# EAGLE design gyrotestbench (EAGLE 6.4)

## Sheet 1 of 5
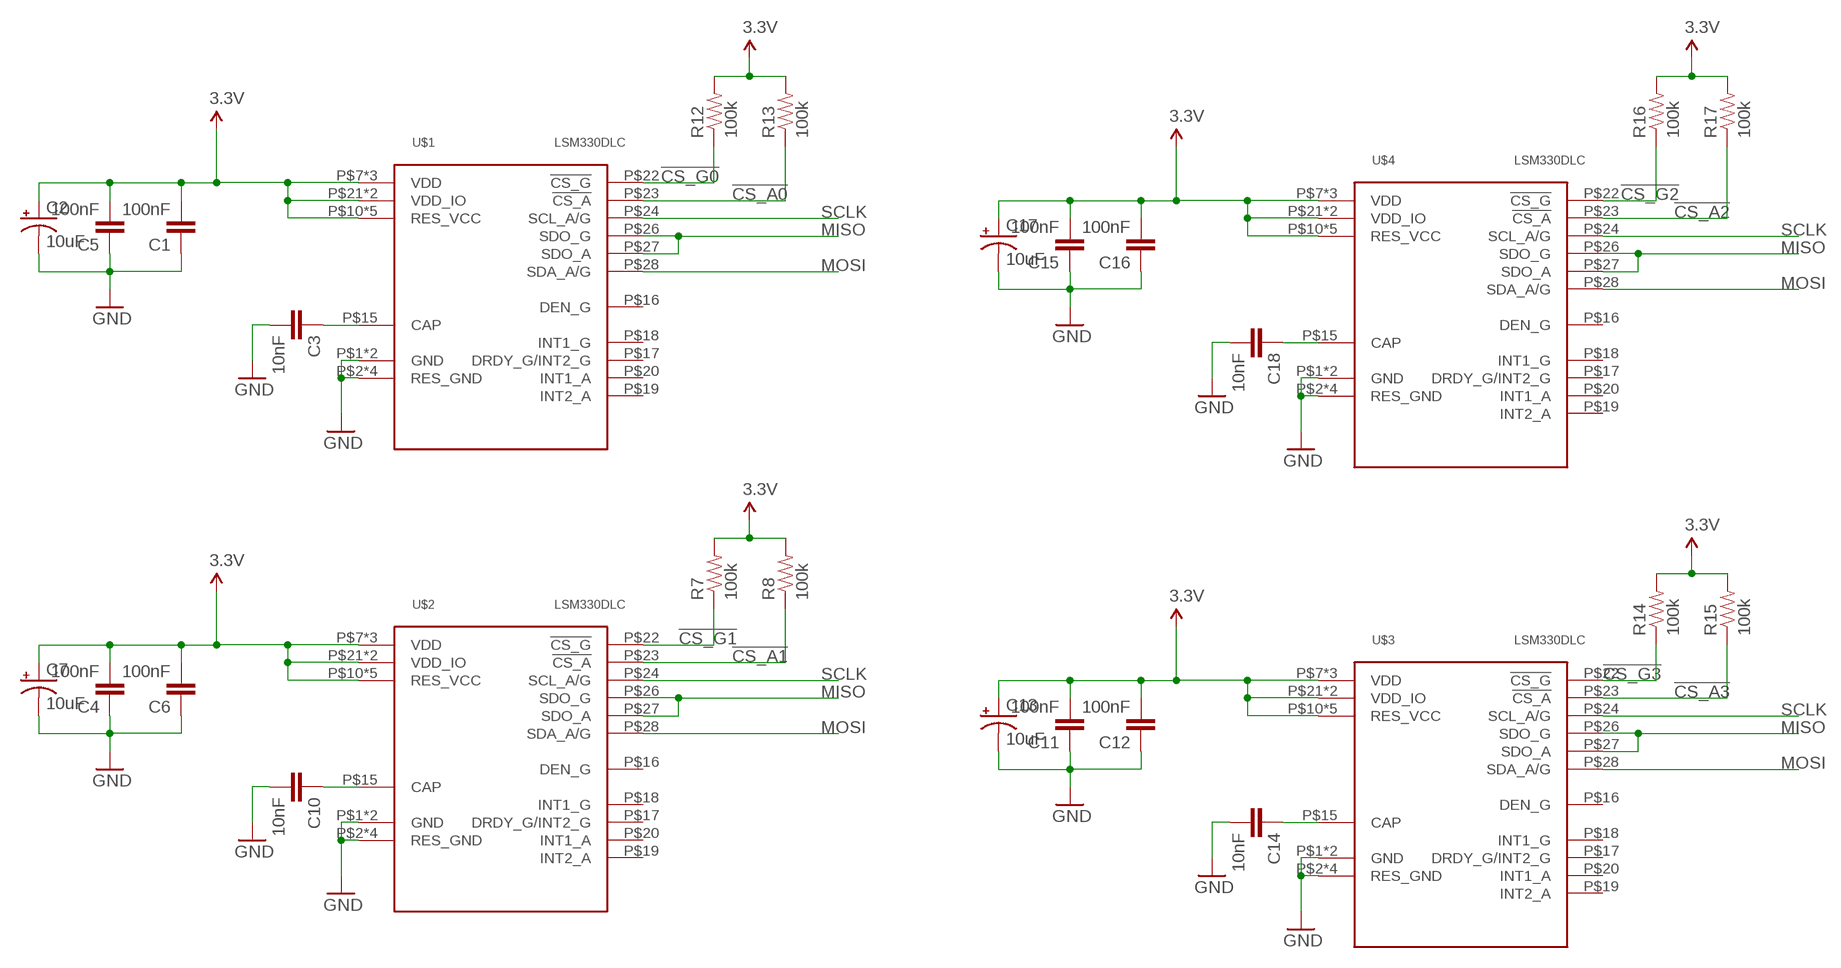
[diagram p0: schematic, sheet 1]

### Parts
C1  100nF  CAP0603-CAP  [0603-CAP]
C2  10uF  CPOL-USB  [PANASONIC_B]
C3  10nF  CAP0603-CAP  [0603-CAP]
C4  100nF  CAP0603-CAP  [0603-CAP]
C5  100nF  CAP0603-CAP  [0603-CAP]
C6  100nF  CAP0603-CAP  [0603-CAP]
C7  10uF  CPOL-USB  [PANASONIC_B]
C10  10nF  CAP0603-CAP  [0603-CAP]
C11  100nF  CAP0603-CAP  [0603-CAP]
C12  100nF  CAP0603-CAP  [0603-CAP]
C13  10uF  CPOL-USB  [PANASONIC_B]
C14  10nF  CAP0603-CAP  [0603-CAP]
C15  100nF  CAP0603-CAP  [0603-CAP]
C16  100nF  CAP0603-CAP  [0603-CAP]
C17  10uF  CPOL-USB  [PANASONIC_B]
C18  10nF  CAP0603-CAP  [0603-CAP]
R7  100k  RESISTOR0603-RES  [0603-RES]
R8  100k  RESISTOR0603-RES  [0603-RES]
R12  100k  RESISTOR0603-RES  [0603-RES]
R13  100k  RESISTOR0603-RES  [0603-RES]
R14  100k  RESISTOR0603-RES  [0603-RES]
R15  100k  RESISTOR0603-RES  [0603-RES]
R16  100k  RESISTOR0603-RES  [0603-RES]
R17  100k  RESISTOR0603-RES  [0603-RES]
U$1  LSM330DLC  [LGA-28]
U$2  LSM330DLC  [LGA-28]
U$3  LSM330DLC  [LGA-28]
U$4  LSM330DLC  [LGA-28]

### Nets
3.3V: C1.2 C2.+ C4.2 C5.2 C6.2 C7.+ C11.2 C12.2 C13.+ C15.2 C16.2 C17.+ R7.2 R8.2 R12.2 R13.2 R14.2 R15.2 R16.2 R17.2 U$1.P$7(VDD) U$1.P$8(VDD) U$1.P$9(VDD) U$1.P$10(RES_VCC) U$1.P$11(RES_VCC) U$1.P$12(RES_VCC) U$1.P$13(RES_VCC) U$1.P$14(RES_VCC) U$1.P$21(VDD_IO) U$1.P$25(VDD_IO) U$2.P$7(VDD) U$2.P$8(VDD) U$2.P$9(VDD) U$2.P$10(RES_VCC) U$2.P$11(RES_VCC) U$2.P$12(RES_VCC) U$2.P$13(RES_VCC) U$2.P$14(RES_VCC) U$2.P$21(VDD_IO) U$2.P$25(VDD_IO) U$3.P$7(VDD) U$3.P$8(VDD) U$3.P$9(VDD) U$3.P$10(RES_VCC) U$3.P$11(RES_VCC) U$3.P$12(RES_VCC) U$3.P$13(RES_VCC) U$3.P$14(RES_VCC) U$3.P$21(VDD_IO) U$3.P$25(VDD_IO) U$4.P$7(VDD) U$4.P$8(VDD) U$4.P$9(VDD) U$4.P$10(RES_VCC) U$4.P$11(RES_VCC) U$4.P$12(RES_VCC) U$4.P$13(RES_VCC) U$4.P$14(RES_VCC) U$4.P$21(VDD_IO) U$4.P$25(VDD_IO) ; also sheet 2,3,4,5
!CS_A0: R13.1 U$1.P$23(!CS_A) ; also sheet 5
!CS_A1: R8.1 U$2.P$23(!CS_A) ; also sheet 5
!CS_A2: R17.1 U$4.P$23(!CS_A) ; also sheet 5
!CS_A3: R15.1 U$3.P$23(!CS_A) ; also sheet 5
!CS_G0: R12.1 U$1.P$22(!CS_G) ; also sheet 5
!CS_G1: R7.1 U$2.P$22(!CS_G) ; also sheet 5
!CS_G2: R16.1 U$4.P$22(!CS_G) ; also sheet 5
!CS_G3: R14.1 U$3.P$22(!CS_G) ; also sheet 5
GND: C1.1 C2.- C3.2 C4.1 C5.1 C6.1 C7.- C10.2 C11.1 C12.1 C13.- C14.2 C15.1 C16.1 C17.- C18.2 U$1.P$1(GND) U$1.P$2(RES_GND) U$1.P$3(RES_GND) U$1.P$4(RES_GND) U$1.P$5(RES_GND) U$1.P$6(GND) U$2.P$1(GND) U$2.P$2(RES_GND) U$2.P$3(RES_GND) U$2.P$4(RES_GND) U$2.P$5(RES_GND) U$2.P$6(GND) U$3.P$1(GND) U$3.P$2(RES_GND) U$3.P$3(RES_GND) U$3.P$4(RES_GND) U$3.P$5(RES_GND) U$3.P$6(GND) U$4.P$1(GND) U$4.P$2(RES_GND) U$4.P$3(RES_GND) U$4.P$4(RES_GND) U$4.P$5(RES_GND) U$4.P$6(GND) ; also sheet 2,3,4,5
MISO: U$1.P$26(SDO_G) U$1.P$27(SDO_A) U$2.P$26(SDO_G) U$2.P$27(SDO_A) U$3.P$26(SDO_G) U$3.P$27(SDO_A) U$4.P$26(SDO_G) U$4.P$27(SDO_A) ; also sheet 5
MOSI: U$1.P$28(SDA_A/G) U$2.P$28(SDA_A/G) U$3.P$28(SDA_A/G) U$4.P$28(SDA_A/G) ; also sheet 5
N$1: C3.1 U$1.P$15(CAP)
N$2: C10.1 U$2.P$15(CAP)
N$3: C14.1 U$3.P$15(CAP)
N$4: C18.1 U$4.P$15(CAP)
SCLK: U$1.P$24(SCL_A/G) U$2.P$24(SCL_A/G) U$3.P$24(SCL_A/G) U$4.P$24(SCL_A/G) ; also sheet 5
Unconnected: U$1.P$16(DEN_G) U$1.P$17(DRDY_G/INT2_G) U$1.P$18(INT1_G) U$1.P$19(INT2_A) U$1.P$20(INT1_A) U$2.P$16(DEN_G) U$2.P$17(DRDY_G/INT2_G) U$2.P$18(INT1_G) U$2.P$19(INT2_A) U$2.P$20(INT1_A) U$3.P$16(DEN_G) U$3.P$17(DRDY_G/INT2_G) U$3.P$18(INT1_G) U$3.P$19(INT2_A) U$3.P$20(INT1_A) U$4.P$16(DEN_G) U$4.P$17(DRDY_G/INT2_G) U$4.P$18(INT1_G) U$4.P$19(INT2_A) U$4.P$20(INT1_A)

## Sheet 2 of 5
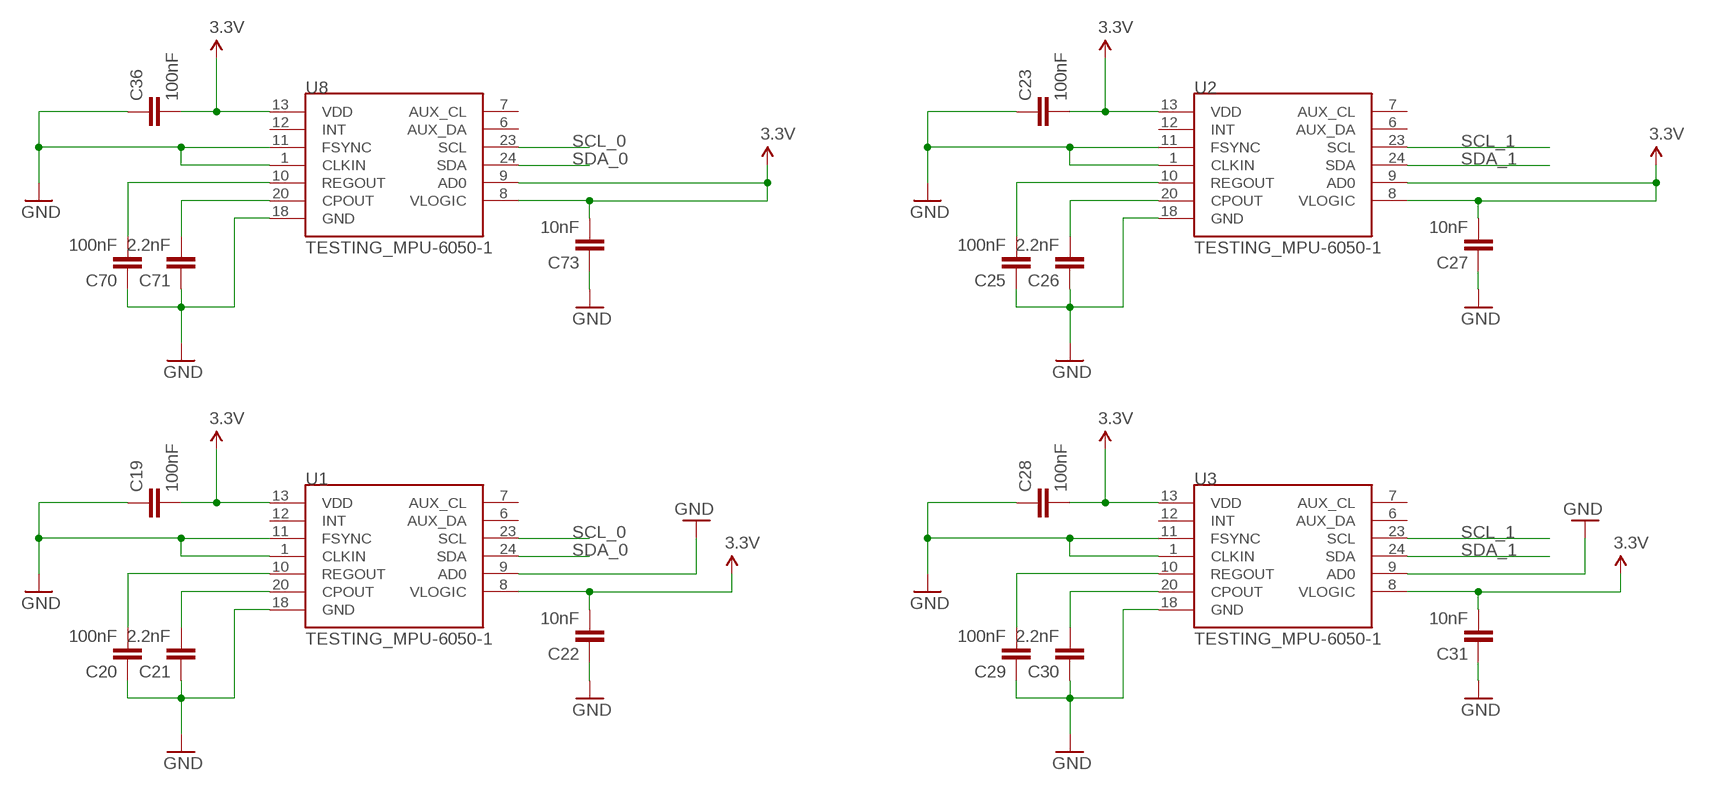
[diagram p1: schematic, sheet 2]

### Parts
C19  100nF  CAP0603-CAP  [0603-CAP]
C20  100nF  CAP0603-CAP  [0603-CAP]
C21  2.2nF  CAP0603-CAP  [0603-CAP]
C22  10nF  CAP0603-CAP  [0603-CAP]
C23  100nF  CAP0603-CAP  [0603-CAP]
C25  100nF  CAP0603-CAP  [0603-CAP]
C26  2.2nF  CAP0603-CAP  [0603-CAP]
C27  10nF  CAP0603-CAP  [0603-CAP]
C28  100nF  CAP0603-CAP  [0603-CAP]
C29  100nF  CAP0603-CAP  [0603-CAP]
C30  2.2nF  CAP0603-CAP  [0603-CAP]
C31  10nF  CAP0603-CAP  [0603-CAP]
C36  100nF  CAP0603-CAP  [0603-CAP]
C70  100nF  CAP0603-CAP  [0603-CAP]
C71  2.2nF  CAP0603-CAP  [0603-CAP]
C73  10nF  CAP0603-CAP  [0603-CAP]
U1  TESTING_MPU-6050-1  [TESTING_QFN-24-4MM2]
U2  TESTING_MPU-6050-1  [TESTING_QFN-24-4MM2]
U3  TESTING_MPU-6050-1  [TESTING_QFN-24-4MM2]
U8  TESTING_MPU-6050-1  [TESTING_QFN-24-4MM2]

### Nets
3.3V: C19.2 C22.2 C23.2 C27.2 C28.2 C31.2 C36.2 C73.2 U1.8(VLOGIC) U1.13(VDD) U2.8(VLOGIC) U2.9(AD0) U2.13(VDD) U3.8(VLOGIC) U3.13(VDD) U8.8(VLOGIC) U8.9(AD0) U8.13(VDD) ; also sheet 1,3,4,5
GND: C19.1 C20.1 C21.1 C22.1 C23.1 C25.1 C26.1 C27.1 C28.1 C29.1 C30.1 C31.1 C36.1 C70.1 C71.1 C73.1 U1.1(CLKIN) U1.9(AD0) U1.11(FSYNC) U1.18(GND) U2.1(CLKIN) U2.11(FSYNC) U2.18(GND) U3.1(CLKIN) U3.9(AD0) U3.11(FSYNC) U3.18(GND) U8.1(CLKIN) U8.11(FSYNC) U8.18(GND) ; also sheet 1,3,4,5
N$5: C20.2 U1.10(REGOUT)
N$6: C21.2 U1.20(CPOUT)
N$7: C25.2 U2.10(REGOUT)
N$8: C26.2 U2.20(CPOUT)
N$9: C29.2 U3.10(REGOUT)
N$10: C30.2 U3.20(CPOUT)
N$38: C70.2 U8.10(REGOUT)
N$39: C71.2 U8.20(CPOUT)
SCL_0: U1.23(SCL) U8.23(SCL) ; also sheet 3
SCL_1: U2.23(SCL) U3.23(SCL) ; also sheet 3
SDA_0: U1.24(SDA) U8.24(SDA) ; also sheet 3
SDA_1: U2.24(SDA) U3.24(SDA) ; also sheet 3
Unconnected: U1.6(AUX_DA) U1.7(AUX_CL) U1.12(INT) U2.6(AUX_DA) U2.7(AUX_CL) U2.12(INT) U3.6(AUX_DA) U3.7(AUX_CL) U3.12(INT) U8.6(AUX_DA) U8.7(AUX_CL) U8.12(INT)

## Sheet 3 of 5
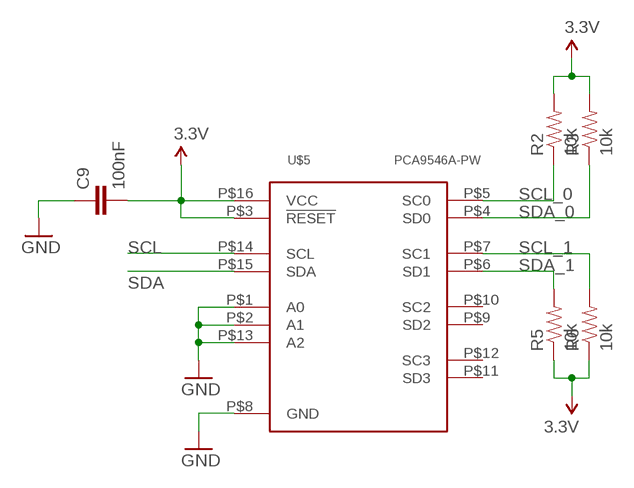
[diagram p2: schematic, sheet 3]

### Parts
C9  100nF  CAP0603-CAP  [0603-CAP]
R2  10k  RESISTOR0603-RES  [0603-RES]
R3  10k  RESISTOR0603-RES  [0603-RES]
R5  10k  RESISTOR0603-RES  [0603-RES]
R6  10k  RESISTOR0603-RES  [0603-RES]
U$5  PCA9546A-PW  [TSSOP-16]

### Nets
3.3V: C9.2 R2.2 R3.2 R5.1 R6.1 U$5.P$3(!RESET) U$5.P$16(VCC) ; also sheet 1,2,4,5
GND: C9.1 U$5.P$1(A0) U$5.P$2(A1) U$5.P$8(GND) U$5.P$13(A2) ; also sheet 1,2,4,5
SCL: U$5.P$14(SCL) ; also sheet 5
SCL_0: R2.1 U$5.P$5(SC0) ; also sheet 2
SCL_1: R6.2 U$5.P$7(SC1) ; also sheet 2
SDA: U$5.P$15(SDA) ; also sheet 5
SDA_0: R3.1 U$5.P$4(SD0) ; also sheet 2
SDA_1: R5.2 U$5.P$6(SD1) ; also sheet 2
Unconnected: U$5.P$9(SD2) U$5.P$10(SC2) U$5.P$11(SD3) U$5.P$12(SC3)

## Sheet 4 of 5
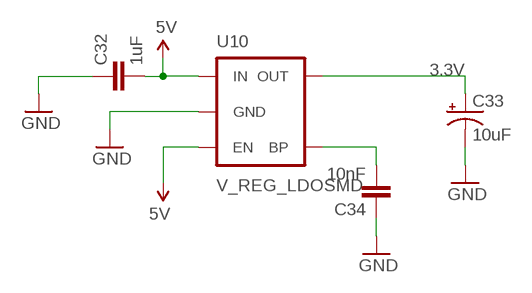
[diagram p3: schematic, sheet 4]

### Parts
C32  1uF  CAP0603-CAP  [0603-CAP]
C33  10uF  CPOL-USB  [PANASONIC_B]
C34  10nF  CAP0603-CAP  [0603-CAP]
U10  V_REG_LDOSMD  [SOT23-5]

### Nets
3.3V: C33.+ U10.5(OUT) ; also sheet 1,2,3,5
5V: C32.2 U10.1(IN) U10.3(EN) ; also sheet 5
GND: C32.1 C33.- C34.1 U10.2(GND) ; also sheet 1,2,3,5
N$11: C34.2 U10.4(BP)

## Sheet 5 of 5
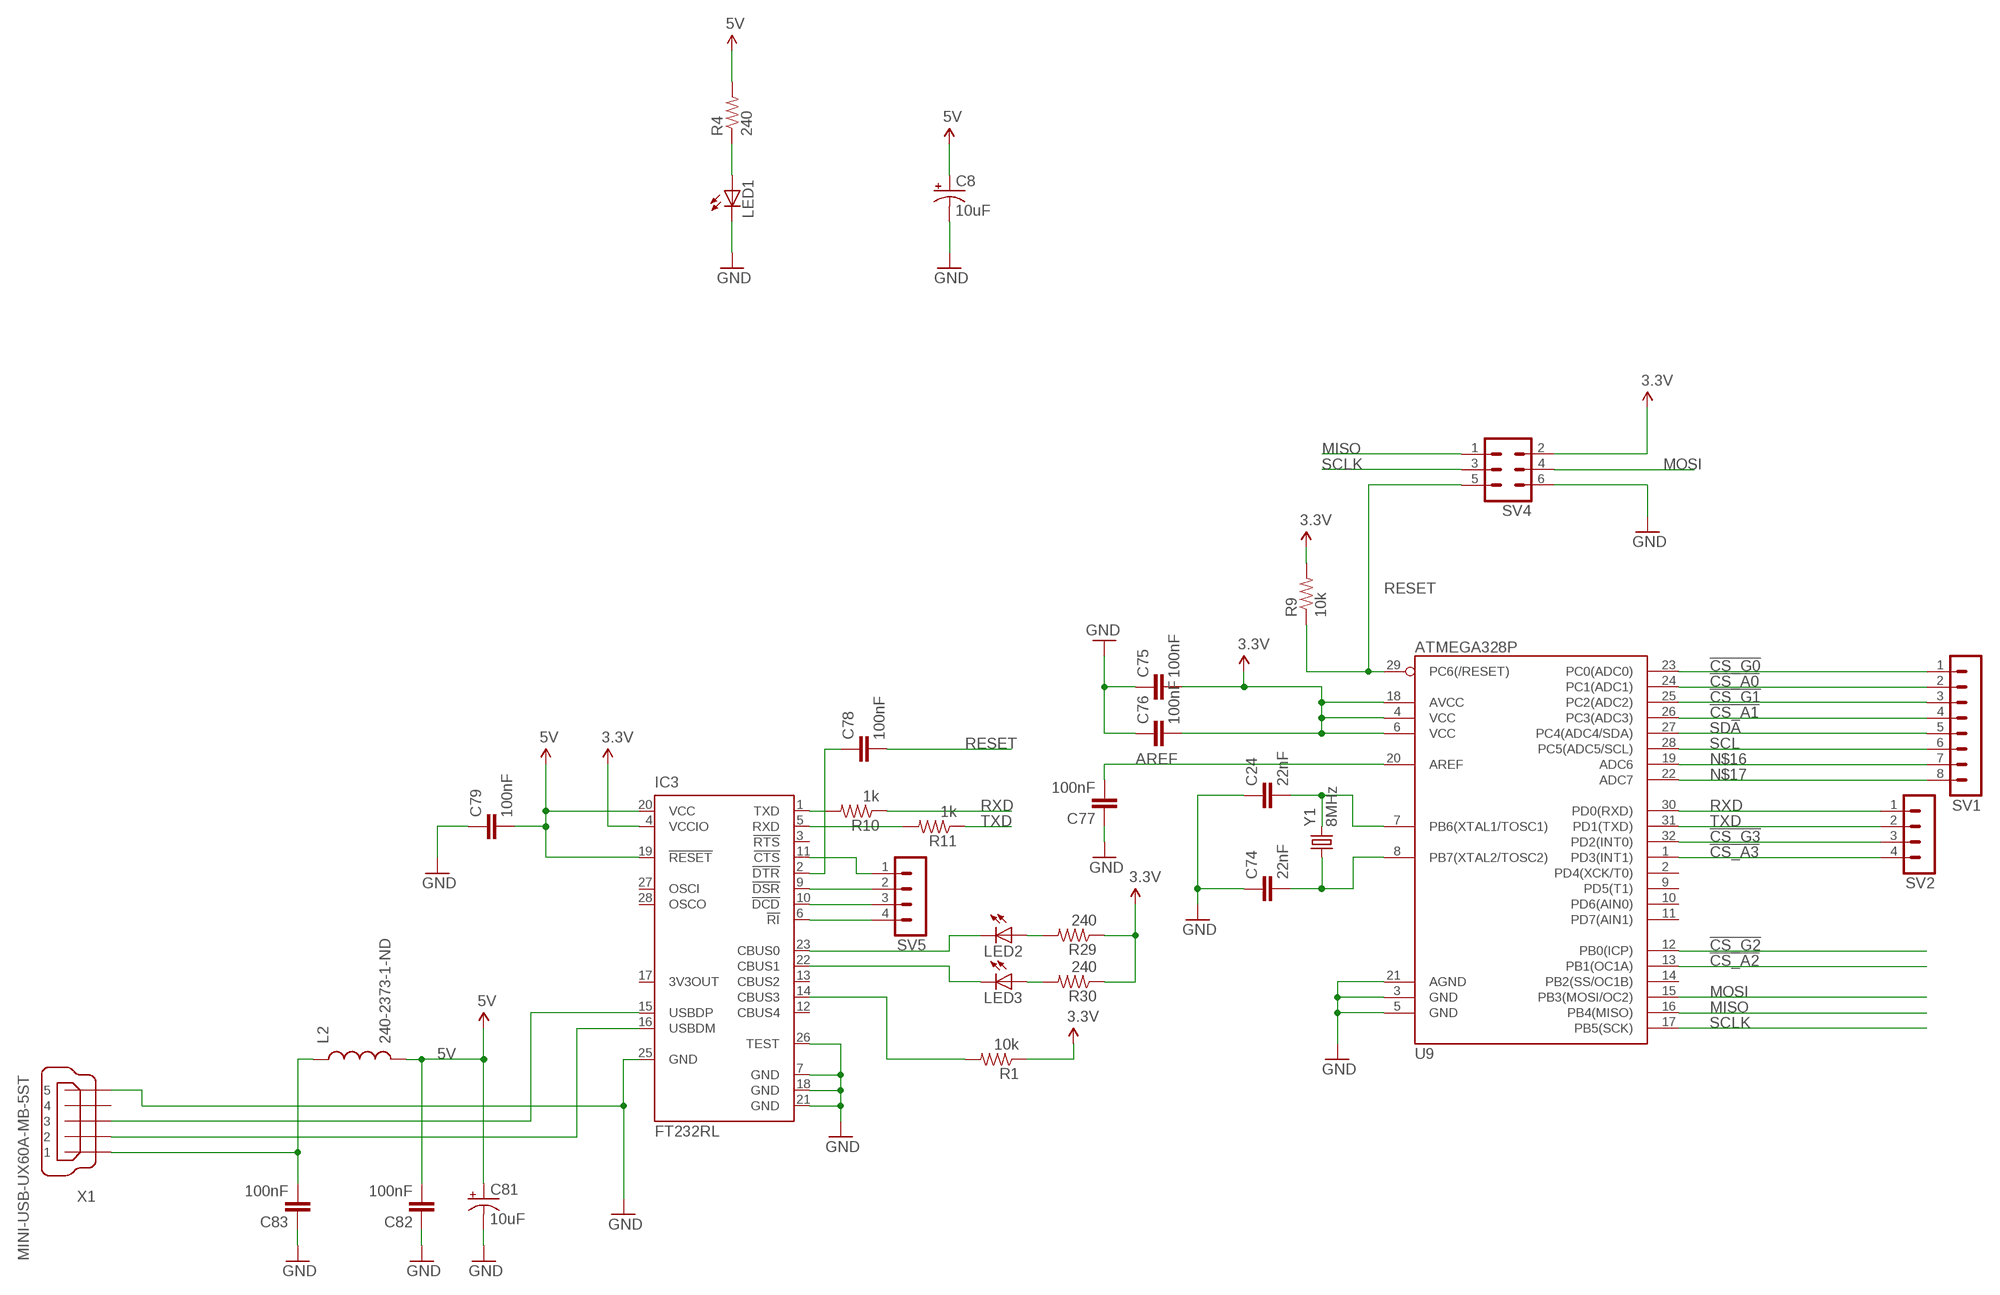
[diagram p4: schematic, sheet 5]

### Parts
C8  10uF  CPOL-USB  [PANASONIC_B]
C24  22nF  CAP0603-CAP  [0603-CAP]
C74  22nF  CAP0603-CAP  [0603-CAP]
C75  100nF  CAP0603-CAP  [0603-CAP]
C76  100nF  CAP0603-CAP  [0603-CAP]
C77  100nF  CAP0603-CAP  [0603-CAP]
C78  100nF  CAP0603-CAP  [0603-CAP]
C79  100nF  CAP0603-CAP  [0603-CAP]
C81  10uF  CPOL-USB  [PANASONIC_B]
C82  100nF  CAP0603-CAP  [0603-CAP]
C83  100nF  CAP0603-CAP  [0603-CAP]
IC3  FT232RL  [SSOP28]
L2  240-2373-1-ND  INDUCTOR0603  [0603]
LED1  LED0603  [LED-0603]
LED2  LED0603  [LED-0603]
LED3  LED0603  [LED-0603]
R1  10k  RESISTOR0603-RES  [0603-RES]
R4  240  RESISTOR0603-RES  [0603-RES]
R9  10k  RESISTOR0603-RES  [0603-RES]
R10  1k  RESISTOR0603-RES  [0603-RES]
R11  1k  RESISTOR0603-RES  [0603-RES]
R29  240  RESISTOR0603-RES  [0603-RES]
R30  240  RESISTOR0603-RES  [0603-RES]
SV1  MA08-1  [MA08-1]
SV2  MA04-1  [MA04-1]
SV4  MA03-2  [MA03-2]
SV5  MA04-1  [MA04-1]
U9  ATMEGA328P  ATMEGA328_SMT  [TQFP32-08]
X1  MINI-USB-UX60A-MB-5ST  [UX60A-MB-5ST]
Y1  8MHz  CRYSTALHC49US  [HC49US]

### Nets
3.3V: C75.2 C76.2 IC3.4(VCCIO) R1.1 R9.2 R29.1 R30.1 SV4.2 U9.4(VCC) U9.6(VCC) U9.18(AVCC) ; also sheet 1,2,3,4
5V: C8.+ C79.2 C81.+ C82.2 IC3.19(!RESET) IC3.20(VCC) L2.2 R4.2 ; also sheet 4
!CS_A0: SV1.2 U9.24(PC1(ADC1)) ; also sheet 1
!CS_A1: SV1.4 U9.26(PC3(ADC3)) ; also sheet 1
!CS_A2: U9.13(PB1(OC1A)) ; also sheet 1
!CS_A3: SV2.4 U9.1(PD3(INT1)) ; also sheet 1
!CS_G0: SV1.1 U9.23(PC0(ADC0)) ; also sheet 1
!CS_G1: SV1.3 U9.25(PC2(ADC2)) ; also sheet 1
!CS_G2: U9.12(PB0(ICP)) ; also sheet 1
!CS_G3: SV2.3 U9.32(PD2(INT0)) ; also sheet 1
AREF: C77.2 U9.20(AREF)
GND: C8.- C24.1 C74.1 C75.1 C76.1 C77.1 C79.1 C81.- C82.1 C83.1 IC3.7(GND) IC3.18(GND) IC3.21(GND) IC3.25(GND) IC3.26(TEST) LED1.C SV4.6 U9.3(GND) U9.5(GND) U9.21(AGND) X1.5 ; also sheet 1,2,3,4
MISO: SV4.1 U9.16(PB4(MISO)) ; also sheet 1
MOSI: SV4.4 U9.15(PB3(MOSI/OC2)) ; also sheet 1
N$12: IC3.14(CBUS3) R1.2
N$13: IC3.15(USBDP) X1.3
N$14: C83.2 L2.1 X1.1
N$15: IC3.16(USBDM) X1.2
N$16: SV1.7 U9.19(ADC6)
N$17: SV1.8 U9.22(ADC7)
N$55: IC3.1(TXD) R10.2
N$74: C78.1 IC3.2(!DTR)
N$84: IC3.5(RXD) R11.2
N$85: IC3.11(!CTS) SV5.1
N$86: IC3.9(!DSR) SV5.2
N$87: C24.2 U9.7(PB6(XTAL1/TOSC1)) Y1.2
N$88: C74.2 U9.8(PB7(XTAL2/TOSC2)) Y1.1
N$89: LED1.A R4.1
N$91: IC3.10(!DCD) SV5.3
N$92: IC3.6(!RI) SV5.4
N$93: IC3.23(CBUS0) LED2.C
N$94: IC3.22(CBUS1) LED3.C
N$95: LED2.A R29.2
N$96: LED3.A R30.2
RESET: C78.2 R9.1 SV4.5 U9.29(PC6(/RESET))
RXD: R10.1 SV2.1 U9.30(PD0(RXD))
SCL: SV1.6 U9.28(PC5(ADC5/SCL)) ; also sheet 3
SCLK: SV4.3 U9.17(PB5(SCK)) ; also sheet 1
SDA: SV1.5 U9.27(PC4(ADC4/SDA)) ; also sheet 3
TXD: R11.1 SV2.2 U9.31(PD1(TXD))
Unconnected: IC3.3(!RTS) IC3.12(CBUS4) IC3.13(CBUS2) IC3.17(3V3OUT) IC3.27(OSCI) IC3.28(OSCO) U9.2(PD4(XCK/T0)) U9.9(PD5(T1)) U9.10(PD6(AIN0)) U9.11(PD7(AIN1)) U9.14(PB2(SS/OC1B)) X1.4

## Library data of the parts
C1 C3-C6 C9-C12 C14-C16 C18-C32 C34 C36 C70 C71 C73-C79 C82 C83 = SparkFun-Capacitors:CAP: Capacitor Standard 0603 ceramic capacitor, and 0.1" leaded capacitor.
C2 C7 C8 C13 C17 C33 C81 = rcl:CPOL-US: POLARIZED CAPACITOR, American symbol
IC3 = ftdichip:FT232R: Source: http://www.ftdichip.com/Documents/DataSheets/DS_FT232R_v104.pdf; MPN: FT232RL; OC_FARNELL: 1146032; OC_NEWARK: 91K9918
L2 = SparkFun-Passives:INDUCTOR: Inductors Basic Inductor/Choke - 0603 and 1206. Footprints are not proven and vary greatly between part numbers.
LED1-LED3 = SparkFun-LED:LED: LEDs Standard schematic elements and footprints for 5mm, 3mm, 1206, and 0603 sized LEDs. 5mm - Spark Fun Electronics SKU : COM-00529 (and others)
R1-R17 R29 R30 = SparkFun-Resistors:RESISTOR: Resistor Basic schematic elements and footprints for 0603, 1206, and PTH resistors.
SV1 = con-lstb:MA08-1: PIN HEADER; OC_FARNELL: unknown; OC_NEWARK: unknown
SV2 SV5 = con-lstb:MA04-1: PIN HEADER; OC_FARNELL: unknown; OC_NEWARK: unknown
SV4 = con-lstb:MA03-2: PIN HEADER; OC_FARNELL: unknown; OC_NEWARK: unknown
U1-U3 U8 = MPU-6050_Breakout_V11:TESTING_MPU-6050
U9 = SparkFun-DigitalIC:ATMEGA328_SMT: 32-Pin Atmega328 part Commonly used on Arduino compatible boards Available in QFP and QFN packages TQFP is IC-09069 QFN is non-stock; PROD_ID: IC-09069
U10 = SparkFun-PowerIC:V_REG_LDO: Voltage Regulator LDO Standard 150mA LDO voltage regulator in SOT-23 layout. Micrel part MIC5205. BP (by-pass) pin is used to lower output noise with 470pF cap.
U$1-U$4 = gyrolib:LSM330DLC; DIGIKEY: 497-12400-1-ND
U$5 = gyrolib:PCA9546A-PW
X1 = con-hirose:MINI-USB-: MINI USB Connector Source: http://www.hirose.co.jp/cataloge_hp/e24000019.pdf; OC_FARNELL: unknown; OC_NEWARK: unknown
Y1 = SparkFun-FreqCtrl:CRYSTAL: Various standard crystals. Proven footprints. Spark Fun Electronics SKU : COM-00534

## Board
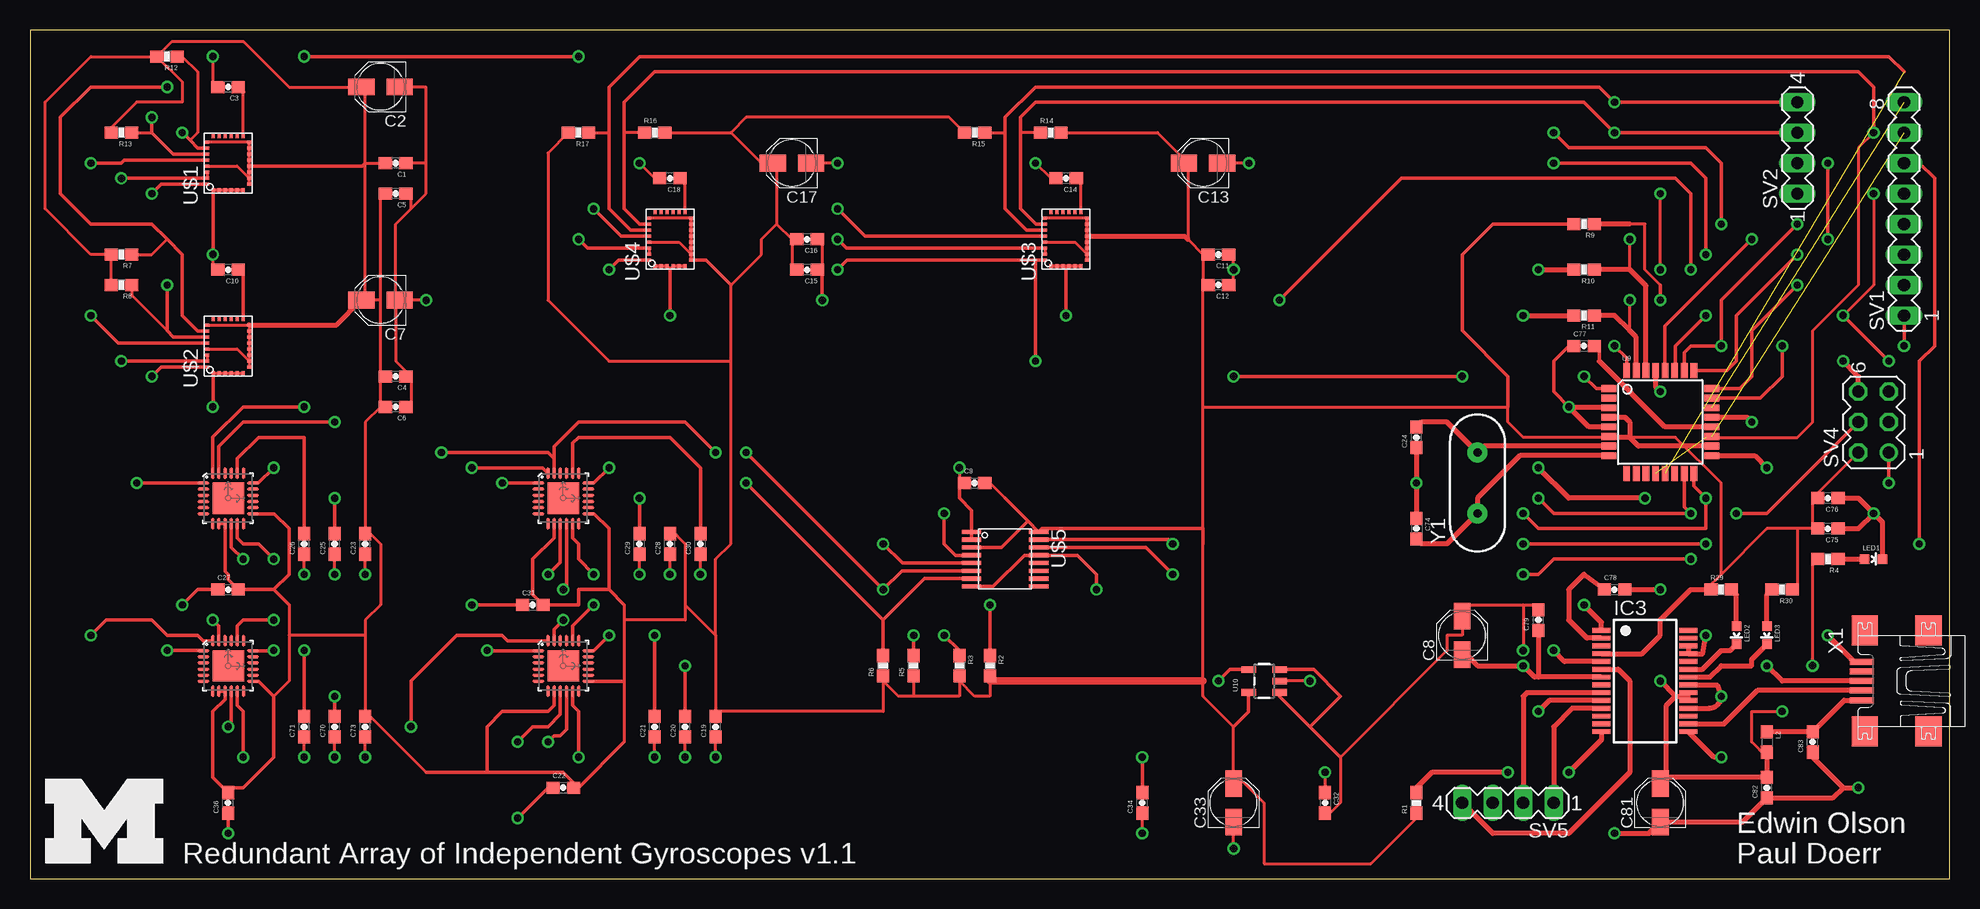
[diagram p5: board, top side]
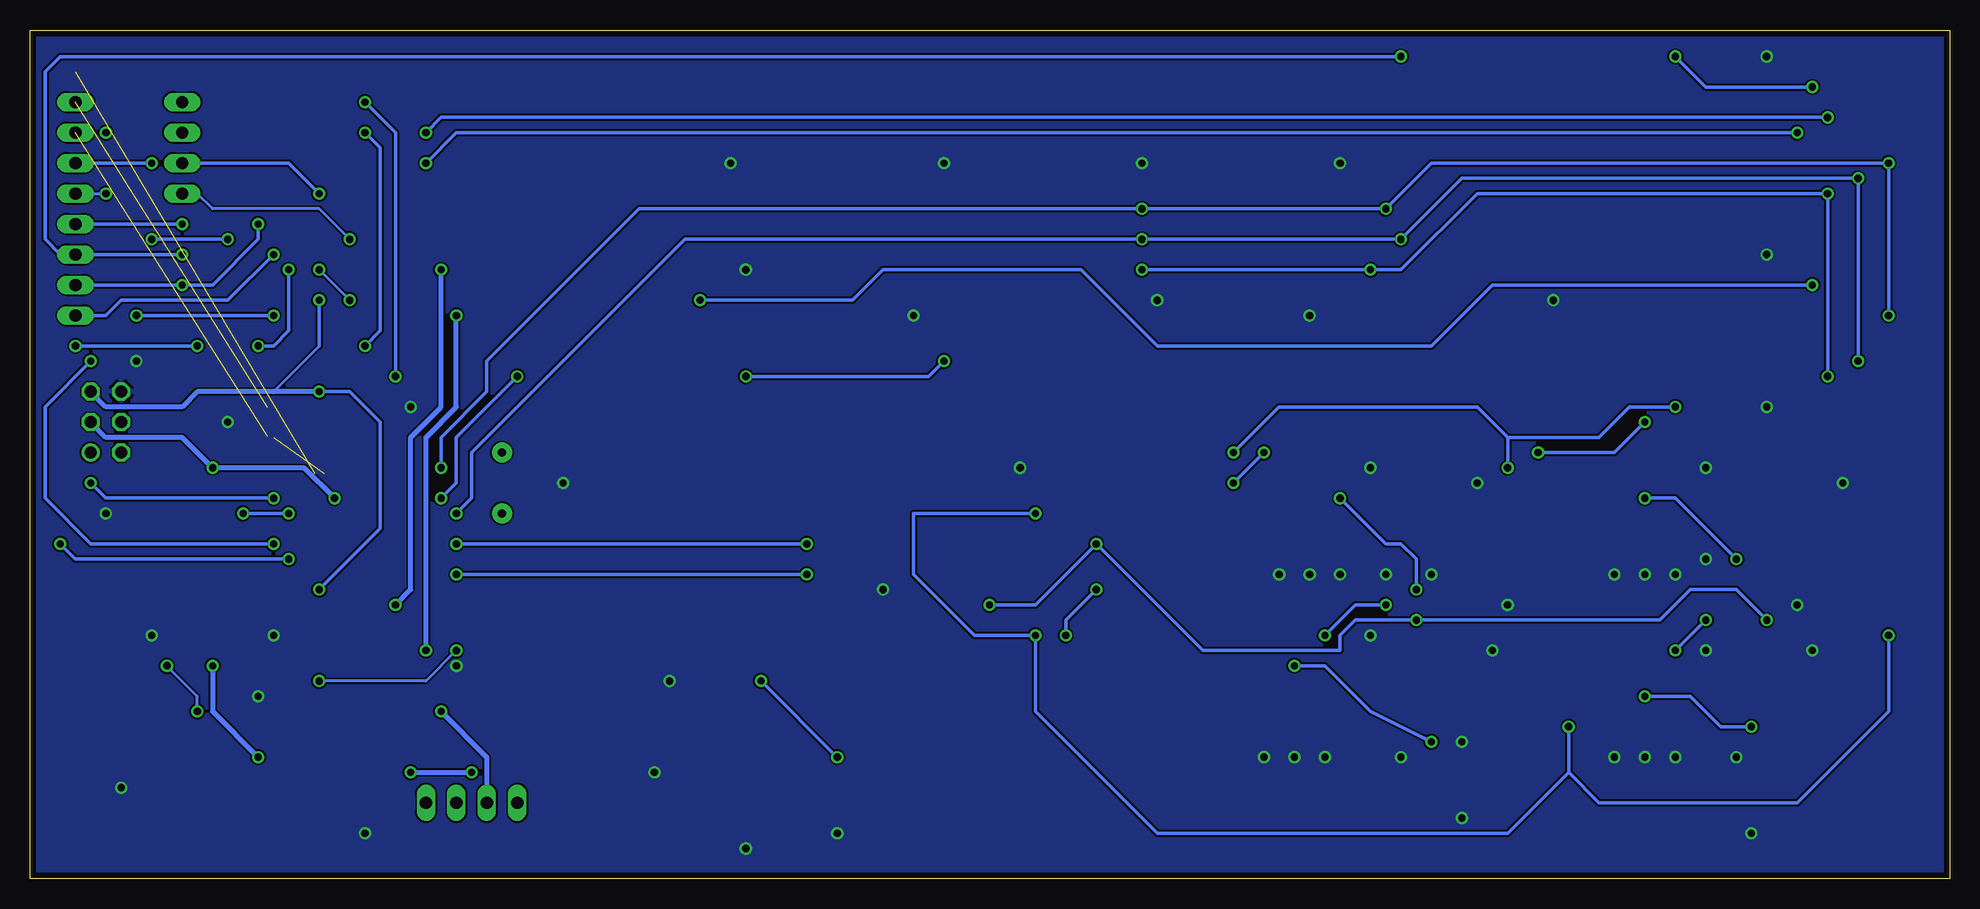
[diagram p6: board, bottom side, seen from below]

Size 160 x 70.79 mm. Coordinates in mm from the lower left corner, seen from the top.
Outline: 0,0 160,0 160,70.79 0,70.79 0,0
Copper layers (1*16): Top 0.0178mm / dielectric 59mil / Bottom 0.0178mm
Design rules "default": minimum track width 6mil, minimum drill 14mil, track to track 6mil, track to pad 6mil, pad to pad 6mil, via to via 6mil, smd to smd 6mil, copper to edge 20mil, drill to drill 16mil, minimum pad ring 8mil, minimum via ring 8mil, stop-mask expansion 3mil, vias tented up to drill 0mil, thermal gap 10mil

### Footprints (pad centres in the part's own frame; a part is rotated, then mirrored left to right if it is on the bottom)
0603-CAP = smd 1.1 x 1: 1 -0.85,0; 2 0.85,0
PANASONIC_B = smd 2.2 x 1.4: + 1.6,0; - -1.6,0
SSOP28 = smd 0.4 x 1.5: 1 -4.225,-3.625; 2 -3.575,-3.625; 3 -2.925,-3.625; 4 -2.275,-3.625; 5 -1.625,-3.625; 6 -0.975,-3.625; 7 -0.325,-3.625; 8 0.325,-3.625; 9 0.975,-3.625; 10 1.625,-3.625; 11 2.275,-3.625; 12 2.925,-3.625; 13 3.575,-3.625; 14 4.225,-3.625; 15 4.225,3.625; 16 3.575,3.625; 17 2.925,3.625; 18 2.275,3.625; 19 1.625,3.625; 20 0.975,3.625; 21 0.325,3.625; 22 -0.325,3.625; 23 -0.975,3.625; 24 -1.625,3.625; 25 -2.275,3.625; 26 -2.925,3.625; 27 -3.575,3.625; 28 -4.225,3.625
0603 = smd 1.1 x 1: 1 -0.85,0; 2 0.85,0
LED-0603 = smd 0.8 x 0.8: A 0,-0.75; C 0,0.75
0603-RES = smd 1.1 x 1: 1 -0.85,0; 2 0.85,0
MA08-1 = drill 1.016 long: 1 -8.89,0; 2 -6.35,0; 3 -3.81,0; 4 -1.27,0; 5 1.27,0; 6 3.81,0; 7 6.35,0; 8 8.89,0
MA04-1 = drill 1.016 long: 1 -3.81,0; 2 -1.27,0; 3 1.27,0; 4 3.81,0
MA03-2 = drill 1.016: 1 -2.54,-1.27 | drill 1.016 octagon: 2 -2.54,1.27; 3 0,-1.27; 4 0,1.27; 5 2.54,-1.27; 6 2.54,1.27
TESTING_QFN-24-4MM2 = smd 1.016 x 0.254: 1 -2.066,1.257; 2 -2.066,0.75; 3 -2.066,0.247; 4 -2.066,-0.287; 5 -2.066,-0.792; 6 -2.066,-1.297; 13 2.086,-1.297; 14 2.086,-0.792; 15 2.086,-0.287; 16 2.086,0.247; 17 2.086,0.75; 18 2.086,1.257 | smd 0.254 x 1.016: 7 -1.267,-2.122; 8 -0.762,-2.122; 9 -0.258,-2.122; 10 0.278,-2.122; 11 0.78,-2.122; 12 1.287,-2.122; 19 1.287,2.082; 20 0.78,2.082; 21 0.278,2.082; 22 -0.258,2.082; 23 -0.762,2.082; 24 -1.267,2.082 | smd 2.616 x 2.616: P$1 0.02,-0.01
TQFP32-08 = smd 1.27 x 0.559: 1 -4.293,2.8; 2 -4.293,2; 3 -4.293,1.2; 4 -4.293,0.4; 5 -4.293,-0.4; 6 -4.293,-1.2; 7 -4.293,-2; 8 -4.293,-2.8; 17 4.293,-2.8; 18 4.293,-2; 19 4.293,-1.2; 20 4.293,-0.4; 21 4.293,0.4; 22 4.293,1.2; 23 4.293,2; 24 4.293,2.8 | smd 0.559 x 1.27: 9 -2.8,-4.293; 10 -2,-4.293; 11 -1.2,-4.293; 12 -0.4,-4.293; 13 0.4,-4.293; 14 1.2,-4.293; 15 2,-4.293; 16 2.8,-4.293; 25 2.8,4.293; 26 2,4.293; 27 1.2,4.293; 28 0.4,4.293; 29 -0.4,4.293; 30 -1.2,4.293; 31 -2,4.293; 32 -2.8,4.293
SOT23-5 = smd 0.55 x 1.2: 1 -0.95,-1.3; 2 0,-1.3; 3 0.95,-1.3; 4 0.95,1.3; 5 -0.95,1.3
LGA-28 = smd 0.325 x 0.25: P$1 -2.25,1.25; P$2 -2.25,0.75; P$3 -2.25,0.25; P$4 -2.25,-0.25; P$5 -2.25,-0.75; P$6 -2.25,-1.25; P$15 2.25,-1.25; P$16 2.25,-0.75; P$17 2.25,-0.25; P$18 2.25,0.25; P$19 2.25,0.75; P$20 2.25,1.25 | smd 0.25 x 0.325: P$7 -1.75,-1.75; P$8 -1.25,-1.75; P$9 -0.75,-1.75; P$10 -0.25,-1.75; P$11 0.25,-1.75; P$12 0.75,-1.75; P$13 1.25,-1.75; P$14 1.75,-1.75; P$21 1.75,1.75; P$22 1.25,1.75; P$23 0.75,1.75; P$24 0.25,1.75; P$25 -0.25,1.75; P$26 -0.75,1.75; P$27 -1.25,1.75; P$28 -1.75,1.75
TSSOP-16 = smd 0.35 x 1.6: P$1 -2.275,-2.8; P$2 -1.625,-2.8; P$3 -0.975,-2.8; P$4 -0.325,-2.8; P$5 0.325,-2.8; P$6 0.975,-2.8; P$7 1.625,-2.8; P$8 2.275,-2.8; P$9 2.275,2.8; P$10 1.625,2.8; P$11 0.975,2.8; P$12 0.325,2.8; P$13 -0.325,2.8; P$14 -0.975,2.8; P$15 -1.625,2.8; P$16 -2.275,2.8
UX60A-MB-5ST = smd 2 x 0.5: 1 2.25,1.6; 2 2.25,0.8; 3 2.25,0; 4 2.25,-0.8; 5 2.25,-1.6 | smd 2.2 x 2.5: M1 -3.3,-4.2; M2 -3.3,4.2; M3 2,4.2; M4 2,-4.2
HC49US = drill 0.7 pad 1.651: 1 -2.54,0; 2 2.54,0

### Placement (x,y rotation side)
C1  30.48,59.69 180 top
C2  29.21,66.04 180 top
C3  16.51,66.04 180 top
C4  30.48,41.91 180 top
C5  30.48,57.15 180 top
C6  30.48,39.37 180 top
C7  29.21,48.26 180 top
C8  119.38,20.32 90 top
C9  78.74,33.02 0 top
C10  16.51,50.8 180 top
C11  99.06,52.07 180 top
C12  99.06,49.53 180 top
C13  97.79,59.69 180 top
C14  86.36,58.42 180 top
C15  64.77,50.8 180 top
C16  64.77,53.34 180 top
C17  63.5,59.69 180 top
C18  53.34,58.42 180 top
C19  57.15,12.7 90 top
C20  54.61,12.7 90 top
C21  52.07,12.7 90 top
C22  44.45,7.62 0 top
C23  27.94,27.94 90 top
C24  115.57,36.83 90 top
C25  25.4,27.94 90 top
C26  22.86,27.94 90 top
C27  16.51,24.13 0 top
C28  53.34,27.94 90 top
C29  50.8,27.94 90 top
C30  55.88,27.94 90 top
C31  41.91,22.86 0 top
C32  107.95,6.35 270 top
C33  100.33,6.35 90 top
C34  92.71,6.35 90 top
C36  16.51,6.35 90 top
C70  25.4,12.7 90 top
C71  22.86,12.7 90 top
C73  27.94,12.7 90 top
C74  115.57,29.21 270 top
C75  149.86,29.21 180 top
C76  149.86,31.75 180 top
C77  129.54,44.45 0 top
C78  132.08,24.13 0 top
C79  125.73,21.59 90 top
C81  135.89,6.35 90 top
C82  144.78,7.62 90 top
C83  148.59,11.43 90 top
IC3  134.62,16.51 270 top
L2  144.78,11.43 270 top
LED1  153.67,26.67 270 top
LED2  142.24,20.32 180 top
LED3  144.78,20.32 180 top
R1  115.57,6.35 90 top
R2  80.01,17.78 270 top
R3  77.47,17.78 270 top
R4  149.86,26.67 180 top
R5  73.66,17.78 90 top
R6  71.12,17.78 90 top
R7  7.62,52.07 180 top
R8  7.62,49.53 180 top
R9  129.54,54.61 180 top
R10  129.54,50.8 180 top
R11  129.54,46.99 180 top
R12  11.43,68.58 180 top
R13  7.62,62.23 180 top
R14  85.09,62.23 0 top
R15  78.74,62.23 180 top
R16  52.07,62.23 0 top
R17  45.72,62.23 180 top
R29  140.97,24.13 0 top
R30  146.05,24.13 180 top
SV1  156.21,55.88 90 top
SV2  147.32,60.96 90 top
SV4  153.67,38.1 90 top
SV5  123.19,6.35 180 top
U1  44.45,17.78 0 top
U2  16.51,31.75 0 top
U3  44.45,31.75 0 top
U8  16.51,17.78 0 top
U9  135.89,38.1 0 top
U10  102.87,16.51 90 top
U$1  16.51,59.69 90 top
U$2  16.51,44.45 90 top
U$3  86.36,53.34 90 top
U$4  53.34,53.34 90 top
U$5  81.28,26.67 270 top
U$6  [BLOCK_M]  1.27,1.27 0 top
X1  154.94,16.51 180 top
Y1  120.65,33.02 90 top

### Tracks (layer width: path | path; a pad name or v marks a point on that pad's centre or on a via)
3.3V
  Top 0.254: 27.94,48.26 27.94,59.69 | 27.94,59.69 27.94,66.04 C2.+ 21.59,66.04 17.78,69.85 11.85,69.85 R12.2 | 27.94,59.69 C1.2 | 20.32,15.24 21.59,16.51 21.59,20.32 | 21.59,22.86 21.59,20.32 | 27.94,20.32 27.94,21.59 29.21,22.86 29.21,27.94 27.94,29.21 | 27.94,20.32 27.94,13.97 | 29.21,39.37 29.21,41.91 | 29.21,41.91 29.21,48.26 | 29.21,48.26 29.21,57.15 C5.2 | 29.21,41.91 C4.2 | 27.94,29.21 27.94,38.1 29.21,39.37 | 27.94,29.21 C23.2 | 29.21,39.37 C6.2 | 27.94,20.32 21.59,20.32 | 29.21,48.26 27.94,48.26 | 27.94,48.26 C7.+ | 49.53,22.86 49.53,21.59 | 49.53,21.59 49.53,16.51 49.53,11.43 | 63.5,53.34 63.5,50.8 C15.2 | 62.23,54.61 63.5,53.34 | 62.23,54.61 62.23,59.69 C17.+ 60.96,59.69 58.42,62.23 | 63.5,53.34 C16.2 | 57.15,20.32 57.15,13.97 | 54.61,22.86 57.15,20.32 | 54.61,22.86 54.61,27.94 53.34,29.21 C28.2 | 62.23,54.61 60.96,53.34 60.96,52.07 58.42,49.53 58.42,43.18 | 58.42,43.18 58.42,27.94 57.15,26.67 57.15,20.32 | 49.53,21.59 54.61,21.59 54.61,22.86 | 33.02,8.89 27.94,13.97 | 27.94,13.97 C73.2 | 128.27,54.61 R9.2 | U9.6 132.08,36.83 124.46,36.83 123.19,38.1 123.19,39.37 97.79,39.37 | 140.97,25.4 144.78,29.21 147.32,29.21 | 140.97,25.4 139.7,24.13 R29.1 | 148.59,29.21 147.32,29.21 | 147.32,29.21 147.32,24.13 R30.1 | 148.59,29.21 148.59,31.75 | 148.59,29.21 C75.2 | 148.59,31.75 SV4.2 | 148.59,31.75 C76.2 | 133.35,36.83 137.16,36.83 140.97,33.02 140.97,25.4 | 71.12,16.51 72.39,15.24 73.66,15.24 | R5.1 73.66,15.24 | 77.47,16.51 78.74,15.24 80.01,15.24 80.01,16.51 R2.2 | 81.28,31.75 80.01,33.02 C9.2 | 73.66,15.24 77.47,15.24 77.47,16.51 | 77.47,16.51 R3.2 | 97.79,52.07 97.79,49.53 | 97.79,52.07 96.52,53.34 96.52,59.69 C13.+ 96.19,60.02 93.98,62.23 R14.2
  Top 0.254: 97.79,52.07 C11.2 | 100.33,8.89 102.87,6.35 102.87,1.27 111.76,1.27 115.57,5.08 R1.1 | 97.79,27.94 97.79,16.51 97.79,15.24 100.33,12.7 100.33,8.89 | 97.79,29.21 97.79,39.37 | 97.79,39.37 97.79,49.53 | 97.79,49.53 C12.2 | 100.33,8.89 C33.+ | 57.15,13.97 71.12,13.97 71.12,16.51 | 57.15,13.97 C19.2 | 71.12,16.51 R6.1 | U$2.P$21 U$2.P$14 U$2.P$13 U$2.P$12 U$2.P$11 U$2.P$10 U$2.P$9 U$2.P$8 | U$2.P$8 U$2.P$7 | U$2.P$25 17.26,44.2 U$2.P$8 | U$1.P$14 U$1.P$21 | U$1.P$25 17.26,59.44 U$1.P$8 | U$4.P$14 U$4.P$21 | U$4.P$25 54.09,53.09 U$4.P$8 | U$3.P$14 U$3.P$21 | U$3.P$25 87.11,53.09 U$3.P$8 | R12.2 12.7,66.46 12.7,64.77 8.89,64.77 6.77,62.65 R13.2 | R12.2 5.08,68.58 1.27,64.77 1.27,55.88 5.08,52.07 R7.2 R8.2 | R17.2 43.18,60.54 43.18,48.26 48.26,43.18 58.42,43.18 | R16.2 58.42,62.23 | R15.2 76.62,63.5 59.69,63.5 58.42,62.23
  Top 0.305: U$1.P$12 U$1.P$13 U$1.P$14 U$1.P$11 U$1.P$10 | U$1.P$9 U$1.P$10 | U$1.P$10 U$1.P$8 U$1.P$7 | U$1.P$10 27.69,59.44 27.94,59.69 | U$4.P$14 U$4.P$13 U$4.P$12 U$4.P$11 U$4.P$10 U$4.P$9 U$4.P$8 U$4.P$7 56.36,51.59 58.42,49.53 | U$3.P$14 U$3.P$13 U$3.P$12 U$3.P$11 U$3.P$10 U$3.P$9 U$3.P$8 U$3.P$7 | U8.13 19.08,16.48 20.32,15.24 20.32,10.16 17.78,7.62 16.93,7.62 C36.2 15.24,8.47 15.24,13.97 16.25,14.98 U8.9 U8.8 | 20.32,24.13 C27.2 16.51,24.98 16.51,25.4 16.25,25.66 U2.9 U2.8 | 20.32,24.13 21.59,22.86 | U2.13 20.35,30.45 21.59,29.21 21.59,25.4 20.32,24.13 | 49.53,11.43 45.72,7.62 | 33.02,8.89 38.1,8.89 | 38.1,8.89 44.45,8.89 45.72,7.62 | 45.72,7.62 C22.2 | U1.13 49.5,16.48 49.53,16.51 | U1.8 43.69,14.48 43.18,13.97 39.37,13.97 38.1,12.7 38.1,8.89 | U3.8 43.69,28.45 41.91,26.67 41.91,23.71 C31.2 45.72,22.86 45.72,24.13 48.26,24.13 | 48.26,24.13 49.53,22.86 | U3.13 47.02,30.45 48.26,29.21 48.26,24.13 | 97.79,27.94 97.79,29.21 84.34,29.21 U$5.P$16 83.19,29.84 | 83.19,29.84 81.28,31.75 | U$5.P$3 80.98,27.64 83.19,29.84 | U10.5 101.57,13.94 100.33,12.7 | 128.27,54.61 121.92,54.61 119.38,52.07 119.38,45.72 123.19,41.91 123.19,39.37
  Top 0.406: U9.18 134.08,36.1 133.35,36.83 | 133.35,36.83 132.08,36.83 131.67,36.83 U9.6 | U9.4 132.95,38.5 133.35,38.1 133.35,36.83 | U$2.P$14 25.55,46.2 C7.+ | U$3.P$11 96.27,53.59 96.52,53.34 | IC3.4 134.35,18.79 135.89,20.32 135.89,21.59 138.43,24.13 R29.1
  Top 0.61: 80.01,16.51 97.79,16.51
5V  (via drill 0.61)
  Top 0.254: v148.59,17.78 148.59,26.67 R4.2 | v146.05,13.97 143.51,13.97 143.51,11.43 144.78,10.16 | C32.2 107.95,5.08 109.22,6.35 109.22,10.16 118.11,19.05 118.11,20.32 119.38,20.32 C8.+ 119.38,22.86 124.46,22.86 | 124.46,22.86 125.73,22.86 C79.2 | 124.46,22.86 v124.46,19.05
  Top 0.305: 109.22,10.16 106.68,12.7 | 106.68,12.7 104.14,15.24 104.14,15.53 U10.1 | U10.3 107,17.46 109.22,15.24 106.68,12.7
  Top 0.406: v135.89,16.51 137.16,15.24 | 137.16,15.24 137.95,15.24 IC3.20 IC3.19 | L2.2 144.78,10.16 C82.2 136.41,8.47 | 136.41,8.47 C81.+ | 136.41,8.47 136.41,14.49 137.16,15.24
  Bottom 0.254: v148.59,17.78 146.05,15.24 v146.05,13.97 | v135.89,16.51 127,16.51 v124.46,19.05
!CS_A0  (via drill 0.6)
  Top 0.254: R13.1 10.16,62.23
  Top 0.305: U9.24 142.5,40.9 143.51,41.91 143.51,45.72 v147.32,49.53 | U$1.P$23 11.95,60.44 10.16,62.23 v10.16,63.5 | v127,62.23 128.27,60.96 139.7,60.96 140.97,59.69 v140.97,54.61
  Bottom 0.305: SV1.2 v147.32,49.53 144.78,49.53 140.97,53.34 v140.97,54.61 | v10.16,63.5 125.73,63.5 v127,62.23
!CS_A1  (via drill 0.6)
  Top 0.254: R8.1 8.47,48.68 11.43,45.72
  Top 0.305: U9.26 137.89,43.91 138.43,44.45 v140.97,44.45 140.97,48.26 v147.32,54.61 | U$2.P$23 11.95,45.2 11.43,45.72 v11.43,49.53 | v138.43,50.8 138.43,57.15 137.16,58.42 114.3,58.42 v104.14,48.26
  Bottom 0.305: v147.32,54.61 SV1.4 | v140.97,44.45 139.7,44.45 138.43,45.72 v138.43,50.8 | v104.14,48.26 91.44,48.26 88.9,50.8 72.39,50.8 66.04,44.45 43.18,44.45 38.1,49.53 v11.43,49.53
!CS_A2  (1 unrouted)
  Top 0.254: R17.1 48.26,62.23
  Top 0.305: U$4.P$23 50.05,54.09 48.26,55.88 48.26,62.23 48.26,66.04 50.8,68.58 154.94,68.58 156.21,67.31
!CS_A3  (via drill 0.6)
  Top 0.254: R15.1 81.28,62.23
  Top 0.305: U9.1 130.55,40.9 v129.54,41.91 | SV2.4 v132.08,64.77 130.81,66.04 83.82,66.04 81.28,63.5 81.28,62.23 81.28,55.88 83.07,54.09 U$3.P$23
  Bottom 0.305: v129.54,41.91 129.54,62.23 v132.08,64.77
!CS_G0  (via drill 0.6)
  Top 0.254: R12.1 12.7,68.58 13.97,67.31 13.97,62.23 13.34,61.59
  Top 0.305: U9.23 144.24,40.1 146.05,41.91 v146.05,44.45 | v156.21,44.45 SV1.1 | U$1.P$22 13.99,60.94 13.34,61.59 v12.7,62.23 | v127,59.69 138.43,59.69 139.7,58.42 v139.7,52.07
  Bottom 0.305: v146.05,44.45 v156.21,44.45 | v139.7,52.07 143.51,48.26 152.4,48.26 153.67,46.99 SV1.1 | v12.7,62.23 124.46,62.23 v127,59.69
!CS_G1  (via drill 0.6)
  Top 0.254: R7.1 10.16,52.07 11.43,53.34
  Top 0.305: v147.32,52.07 142.24,46.99 142.24,43.18 141.45,42.39 U9.25 | U$2.P$22 13.99,45.7 12.7,46.99 12.7,52.07 11.43,53.34 10.16,54.61 5.08,54.61 2.54,57.15 2.54,63.5 5.08,66.04 v11.43,66.04 | v22.86,68.58 v45.72,68.58
  Bottom 0.305: v147.32,52.07 SV1.3 157.48,52.07 158.75,53.34 158.75,67.31 157.48,68.58 v45.72,68.58 | v11.43,66.04 20.32,66.04 v22.86,68.58
!CS_G2  (via drill 0.61)  (1 unrouted)
  Top 0.254: v153.67,62.23 152.4,60.96 152.4,49.53 148.59,45.72 148.59,38.1 147.32,36.83 139.7,36.83 | R16.1 49.53,62.23
  Top 0.305: U$4.P$22 50.82,54.59 49.53,55.88 49.53,62.23 49.53,64.77 52.07,67.31 152.4,67.31 153.67,66.04 v153.67,62.23
!CS_G3  (via drill 0.6)
  Top 0.254: R14.1 82.55,62.23
  Top 0.305: U9.32 133.09,43.44 v132.08,44.45 | SV2.3 v132.08,62.23 129.54,64.77 83.82,64.77 82.55,63.5 82.55,62.23 82.55,55.88 83.84,54.59 U$3.P$22
  Bottom 0.305: v132.08,44.45 130.81,45.72 130.81,60.96 v132.08,62.23
AREF
  Top 0.305: 130.81,43.18 130.81,44.03 C77.2
  Top 0.406: U9.20 136.29,37.7 130.81,43.18
GND  (via drill 0.6, 0.61)
  Top 0.254: 31.75,41.91 31.75,39.37 C6.1 | C2.- 33.02,66.04 33.02,59.69 | 33.02,59.69 33.02,57.15 31.75,55.88 | 31.75,55.88 30.48,54.61 30.48,48.26 | 31.75,55.88 31.75,57.15 C5.1 | 33.02,59.69 C1.1 | 31.75,41.91 30.48,43.18 30.48,48.26 | 31.75,41.91 C4.1 | 30.48,48.26 C7.- v33.02,48.26 | C11.1 100.33,52.07 v100.33,50.8 100.33,49.53 C12.1 | C15.1 66.04,50.8 v66.04,48.26 66.04,53.34 C16.1 | v22.86,10.16 C71.1 | v25.4,10.16 C70.1 | v27.94,10.16 C73.1 | v22.86,25.4 C26.1 | v25.4,25.4 C25.1 | v27.94,25.4 C23.1 | v52.07,10.16 C21.1 | v54.61,10.16 C20.1 | v57.15,10.16 C19.1 | v15.24,52.07 15.24,50.8 C10.2 | v50.8,25.4 C29.1 | v53.34,25.4 C28.1 | v55.88,25.4 C30.1 | v15.24,68.58 15.24,66.04 C3.2 | v92.71,3.81 C34.1 | v77.47,34.29 77.47,33.02 C9.1 | v107.95,8.89 C32.1 | v106.68,16.51 U10.2 104.14,16.51 | v100.33,2.54 C33.- | v67.31,59.69 C17.- | v101.6,59.69 C13.- | U$2.P$1 U$2.P$2 U$2.P$3 U$2.P$4 U$2.P$5 U$2.P$6 | C14.2 85.09,58.42 v83.82,59.69 | C18.2 52.07,58.42 v50.8,59.69
  Top 0.305: U$1.P$6 U$1.P$5 U$1.P$4 U$1.P$3 U$1.P$2 U$1.P$1 15.26,52.09 v15.24,52.07 | U$2.P$1 15.26,39.39 v15.24,39.37 | v53.34,46.99 53.34,50.84 | 53.34,50.84 U$4.P$3 U$4.P$2 U$4.P$1 | 53.34,50.84 U$4.P$4 U$4.P$5 U$4.P$6 | U$3.P$1 U$3.P$2 U$3.P$3 | U$3.P$3 U$3.P$4 U$3.P$5 U$3.P$6 | v86.36,46.99 86.36,50.84 U$3.P$3 | v11.43,19.05 U8.1 | U8.18 20.31,19.04 v20.32,19.05 | U8.11 17.29,14.46 17.78,13.97 v17.78,10.16 | C36.1 v16.51,3.81 | C27.1 13.97,24.13 v12.7,22.86 | U2.11 17.29,28.43 17.78,27.94 19.05,27.94 v20.32,26.67 | U2.18 19.04,33.01 v20.32,34.29 | U2.1 8.9,33.01 v8.89,33.02 | U1.18 46.98,19.04 v48.26,20.32 | U1.1 38.11,19.04 v38.1,19.05 | C22.1 43.18,7.62 v40.64,5.08 | U1.11 45.23,14.46 45.72,13.97 v45.72,10.16 | U1.9 44.19,13.71 43.18,12.7 41.91,12.7 v40.64,11.43 | C31.1 v36.83,22.86 | U3.9 44.19,26.41 v43.18,25.4 | U3.11 45.23,28.43 45.72,27.94 45.72,26.67 v46.99,25.4 | U3.1 39.38,33.01 v39.37,33.02 | U3.18 46.98,33.01 v48.26,34.29 | U$5.P$2 U$5.P$1 78.48,30.74 77.47,31.75 77.47,32.6 C9.1 | U$5.P$8 80.28,24.39 82.88,27 U$5.P$13 87.31,27 88.9,25.4 v88.9,24.13 | C77.1 128.27,44.45 127,43.18 127,40.64 v128.27,39.37
  Top 0.406: IC3.26 IC3.25 139.44,18.79 v139.7,20.32 | IC3.18 139.97,14.23 arc90 v140.97,15.24 140.65,16.18 IC3.21 | IC3.7 125.73,16.84 | 125.73,16.84 125.41,16.84 v124.46,17.78 120.65,17.78 119.71,18.72 C8.- | C24.1 v115.57,33.02 C74.1 | C79.1 125.73,16.84 | C83.1 148.59,10.16 151.13,7.62 | 151.13,7.62 v152.4,7.62 | v132.08,3.81 134.95,3.81 C81.- 142.76,4.75 C82.1 150.28,6.77 151.13,7.62 | U9.3 128.34,39.3 v128.27,39.37 129.94,37.7 U9.5 | SV4.6 152.4,41.91 v151.13,43.18 | U9.21 143.11,38.5 v143.51,38.1 | C76.1 152.4,31.75 v153.67,30.48 | C75.1 152.4,29.21 v153.67,30.48 | LED1.C 154.42,29.73 v153.67,30.48 | X1.5 152.07,18.11 v149.86,20.32
  pour Bottom: 160.02,71.12 0,71.12 0,0 160.02,0
MISO  (via drill 0.6)
  Top 0.254: U$2.P$26 U$2.P$27 | U$1.P$26 U$1.P$27 | U$4.P$26 U$4.P$27 | U$3.P$26 U$3.P$27
  Top 0.305: v154.94,33.02 SV4.1 | 14.74,43.18 U$2.P$27 10.18,43.2 10.16,43.18 v7.62,43.18 | U$1.P$27 7.64,58.44 v7.62,58.42 | U$4.P$26 46.47,52.59 v45.72,53.34 | U$3.P$26 68.06,52.59 v67.31,53.34 | U9.16 138.69,32.76 v139.7,31.75 139.7,29.21 125.73,29.21 v124.46,30.48
  Bottom 0.305: v139.7,31.75 153.67,31.75 v154.94,33.02 | v7.62,43.18 v7.62,58.42 40.64,58.42 v45.72,53.34 v67.31,53.34 105.41,53.34 123.19,35.56 123.19,31.75 v124.46,30.48
MOSI  (via drill 0.6)
  Top 0.305: SV4.4 144.78,30.48 v142.24,30.48 | 12.22,42.7 U$2.P$28 10.95,42.7 v10.16,41.91 | U$1.P$28 10.95,57.94 v10.16,57.15 | U$4.P$28 49.05,51.59 v48.26,50.8 | U$3.P$28 83.82,51.59 | 83.82,51.59 68.1,51.59 v67.31,50.8 | U9.15 137.89,31.02 v138.43,30.48 127,30.48 v125.73,31.75 | v119.38,41.91 v100.33,41.91 | v83.82,43.18 83.82,51.59
  Bottom 0.305: v138.43,30.48 v142.24,30.48 | v10.16,41.91 v10.16,57.15 39.37,57.15 45.72,50.8 v48.26,50.8 v67.31,50.8 | v125.73,31.75 124.46,33.02 124.46,36.83 v119.38,41.91 | v100.33,41.91 85.09,41.91 v83.82,43.18
N$1
  Top 0.254: U$1.P$15 17.76,65.64
  Top 0.406: 17.76,65.64 C3.1
N$2
  Top 0.305: U$2.P$15 17.76,50.4 C10.1
N$3
  Top 0.254: U$3.P$15 87.61,58.02 C14.1
N$4
  Top 0.254: U$4.P$15 54.59,58.02 C18.1
N$5  (via drill 0.6)
  Top 0.305: v54.61,17.78 C20.2 | U1.10 44.73,12.47 44.2,11.94 43.69,11.94 v43.18,11.43
  Bottom 0.305: v43.18,11.43 48.26,13.97 52.07,17.78 v54.61,17.78
N$6  (via drill 0.6)
  Top 0.305: U1.20 45.23,21.1 v46.99,22.86 | v52.07,20.32 C21.2
  Bottom 0.305: v46.99,22.86 49.53,22.86 v52.07,20.32
N$7  (via drill 0.6)
  Top 0.305: U2.10 16.79,27.66 v17.78,26.67 | v25.4,31.75 C25.2
  Bottom 0.305: v17.78,26.67 22.86,31.75 v25.4,31.75
N$8
  Top 0.305: U2.20 17.29,35.07 19.05,36.83 22.86,36.83 C26.2
N$9  (via drill 0.6)
  Top 0.305: U3.10 44.73,24.41 v44.45,24.13 | v50.8,31.75 C29.2
  Bottom 0.305: v44.45,24.13 44.45,26.67 45.72,27.94 46.99,27.94 v50.8,31.75
N$10
  Top 0.305: U3.20 45.23,36.34 45.72,36.83 53.34,36.83 55.88,34.29 C30.2
N$11  (via drill 0.6)
  Top 0.305: U10.4 100.01,17.46 v99.06,16.51 | v92.71,10.16 C34.2
  Bottom 0.305: v99.06,16.51 v92.71,10.16
N$12  (via drill 0.6)
  Top 0.406: IC3.14 131,11.62 v128.27,8.89 | v123.19,8.89 116.84,8.89 115.57,7.62 R1.2
  Bottom 0.406: v128.27,8.89 v123.19,8.89
N$13  (via drill 0.6)
  Top 0.406: v144.78,17.78 146.05,16.51 X1.3 | v140.97,10.16 140.37,10.16 IC3.15
  Bottom 0.406: v144.78,17.78 144.78,13.97 v140.97,10.16
N$14
  Top 0.406: L2.1 C83.2 151.22,14.91 X1.1
N$15
  Top 0.406: X1.2 143.98,15.71 141.21,12.94 IC3.16
N$16  (1 unrouted)
N$17  (1 unrouted)
N$38  (via drill 0.6)
  Top 0.305: U8.10 16.79,12.98 v16.51,12.7 | v25.4,15.24 C70.2
  Bottom 0.305: v16.51,12.7 19.05,12.7 21.59,15.24 v25.4,15.24
N$39  (via drill 0.6)
  Top 0.305: U8.20 17.29,21.1 17.78,21.59 v20.32,21.59 | C71.2 v22.86,19.05
  Bottom 0.305: v22.86,19.05 v20.32,21.59
N$55  (via drill 0.6)
  Top 0.406: IC3.1 131,21.41 v129.54,22.86 | v125.73,50.8 R10.2
  Bottom 0.406: v129.54,22.86 128.27,24.13 128.27,36.83 125.73,39.37 v125.73,50.8
N$74
  Top 0.406: C78.1 129.54,25.4 128.27,24.13 128.27,21.59 129.78,20.09 IC3.2
N$84  (via drill 0.6)
  Top 0.406: IC3.5 127.92,18.14 v127,19.05 | v124.46,46.99 R11.2
  Bottom 0.406: v127,19.05 127,36.83 124.46,39.37 v124.46,46.99
N$85
  Top 0.406: IC3.11 128.53,14.23 127,12.7 SV5.1
N$86
  Top 0.406: IC3.9 124.75,15.54 124.46,15.24 SV5.2
N$87
  Top 0.406: U9.7 121.19,36.1 Y1.2 118.11,38.1 115.99,38.1 C24.2
N$88
  Top 0.406: U9.8 124.2,35.3 120.65,31.75 Y1.1 118.11,27.94 115.99,27.94 C74.2
N$89
  Top 0.406: R4.1 LED1.A
N$91  (via drill 0.6)
  Top 0.406: IC3.10 126.64,14.88 v125.73,13.97
  Bottom 0.406: v125.73,13.97 121.92,10.16 SV5.3
N$92
  Top 0.406: IC3.6 132.38,17.48 133.35,16.51 133.35,8.89 128.27,3.81 121.92,3.81 SV5.4
N$93
  Top 0.406: IC3.23 139.41,17.48 140.97,19.05 141.72,19.05 LED2.C
N$94
  Top 0.406: IC3.22 140.03,16.84 140.97,17.78 143.51,17.78 143.51,18.3 LED3.C
N$95
  Top 0.406: LED2.A 142.24,23.71 R29.2
N$96
  Top 0.406: LED3.A 144.78,23.71 R30.2
RESET  (via drill 0.6)
  Top 0.254: 133.35,54.61 134.62,54.61 134.62,50.8 135.89,49.53
  Top 0.305: v135.89,48.26 135.89,49.53
  Top 0.406: U9.29 135.49,41.04 v135.89,40.64 | 133.35,54.61 R9.1 | C78.2 v135.89,24.13
  Bottom 0.254: 139.7,40.64 135.89,44.45
  Bottom 0.305: 135.89,44.45 v135.89,48.26 | v135.89,24.13 130.81,29.21 130.81,38.1 133.35,40.64 v135.89,40.64
  Bottom 0.406: v135.89,40.64 139.7,40.64 146.05,40.64 147.32,39.37 153.67,39.37 SV4.5
RXD  (via drill 0.61)
  Top 0.254: 133.35,50.8 v133.35,53.34
  Top 0.406: U9.30 134.69,49.46 133.35,50.8 R10.1
  Bottom 0.254: SV2.1 146.05,57.15 144.78,55.88 135.89,55.88 v133.35,53.34
SCL  (via drill 0.6)
  Top 0.305: U9.28 136.29,46.12 v143.51,53.34 | v149.86,53.34 v149.86,59.69 | U$5.P$14 93,27.64 v95.25,25.4 | v124.46,25.4 125.73,25.4 127,26.67 v138.43,26.67 | v157.48,27.94 157.48,43.18 158.75,44.45 158.75,58.42 157.48,59.69 SV1.6
  Bottom 0.305: v143.51,53.34 v149.86,53.34 | v149.86,59.69 SV1.6 | v95.25,25.4 v124.46,25.4 | v138.43,26.67 156.21,26.67 v157.48,27.94
SCL_0  (via drill 0.6)
  Top 0.305: U$5.P$5 72.72,26.34 v71.12,27.94 | v80.01,22.86 R2.1 | U1.23 43.69,20.83 v44.45,21.59 | U8.23 15.75,21.08 v15.24,21.59
  Bottom 0.305: v80.01,22.86 76.2,22.86 v71.12,27.94 62.23,19.05 50.8,19.05 50.8,20.32 49.53,21.59 v44.45,21.59 24.13,21.59 21.59,24.13 17.78,24.13 v15.24,21.59
SCL_1  (via drill 0.6)
  Top 0.305: U2.23 15.75,36.07 17.78,38.1 v25.4,38.1 | v34.29,35.56 43.18,35.56 43.69,35.05 U3.23 43.69,36.07 45.72,38.1 54.61,38.1 v57.15,35.56 | v59.69,33.02 71.12,21.59 | R6.2 71.12,21.59 | U$5.P$7 74.58,25.05 71.12,21.59
  Bottom 0.305: v25.4,38.1 27.94,35.56 v34.29,35.56 | v57.15,35.56 v59.69,33.02
SCLK  (via drill 0.6)
  Top 0.305: U$3.P$24 69.6,53.59 v67.31,55.88 | U$4.P$24 49.28,53.59 v46.99,55.88 | v5.08,59.69 7.62,59.69 7.87,59.94 U$1.P$24 | U$2.P$24 7.37,44.7 v5.08,46.99
  Top 0.406: U9.17 143.77,35.3 v144.78,34.29 | v134.62,31.75 128.27,31.75 v125.73,34.29
  Bottom 0.305: v5.08,46.99 v5.08,59.69 43.18,59.69 v46.99,55.88 v67.31,55.88 109.22,55.88 121.92,43.18 121.92,40.64 125.73,36.83 v125.73,34.29
  Bottom 0.406: SV4.3 153.67,36.83 147.32,36.83 v144.78,34.29 137.16,34.29 v134.62,31.75
SDA  (via drill 0.6, 0.61)
  Top 0.254: v151.13,46.99 153.67,49.53 v153.67,57.15 | 137.16,41.91 U9.27
  Top 0.305: U$5.P$15 94.89,28.3 v95.25,27.94 | 137.16,41.91 137.16,44.45 v139.7,46.99 | v124.46,27.94 v139.7,27.94 | v154.94,43.18 v151.13,46.99
  Bottom 0.254: SV1.5 v153.67,57.15
  Bottom 0.305: v139.7,46.99 v151.13,46.99 | v95.25,27.94 v124.46,27.94 | v139.7,27.94 154.94,27.94 158.75,31.75 158.75,39.37 v154.94,43.18
SDA_0  (via drill 0.6)
  Top 0.305: v5.08,20.32 6.35,21.59 10.16,21.59 11.43,20.32 13.97,20.32 14.43,19.86 U8.24 | U1.24 39.83,19.86 39.37,20.32 35.56,20.32 31.75,16.51 v31.75,12.7 | R3.1 77.47,19.05 v76.2,20.32 | U$5.P$4 77.14,27 76.2,27.94 v76.2,30.48
  Bottom 0.305: 31.75,8.89 29.21,6.35 12.7,6.35 5.08,13.97 v5.08,20.32 | v31.75,12.7 31.75,8.89 | 31.75,8.89 36.83,3.81 66.04,3.81 76.2,13.97 v76.2,20.32 81.28,20.32 86.36,25.4 86.36,30.48 v76.2,30.48
SDA_1  (via drill 0.6)
  Top 0.305: U2.24 15.24,36.83 17.78,39.37 v22.86,39.37 | v36.83,34.29 42.73,34.29 U3.24 | R5.2 v73.66,20.32 | U$5.P$6 72.69,25.7 v71.12,24.13 v59.69,35.56
  Bottom 0.305: v22.86,39.37 26.67,39.37 29.21,36.83 36.83,36.83 | 36.83,36.83 v36.83,34.29 | v73.66,20.32 73.66,21.59 v71.12,24.13 | v59.69,35.56 55.88,39.37 39.37,39.37 36.83,36.83
TXD  (via drill 0.61)
  Top 0.254: v135.89,50.8 v135.89,57.15 | 133.35,45.72 v133.35,48.26
  Top 0.406: U9.31 133.89,45.18 133.35,45.72 132.08,46.99 R11.1
  Bottom 0.254: v133.35,48.26 v135.89,50.8
  Bottom 0.305: v135.89,57.15 138.43,59.69 SV2.2

### Text on the board
tPlace: Edwin Olson | Redundant Array of Independent Gyroscopes v1.1 | Paul Doerr